# EAGLE design RJ45 - Breakout (EAGLE 9.6.2)
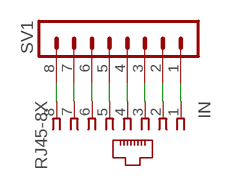
[diagram p0: schematic, sheet 1]

## Parts
IN  RJ45-8X  [RJ45-NO-SHIELD]
SV1  MA08-1  [MA08-1]

## Nets
1: IN.1 SV1.1
2: IN.2 SV1.2
3: IN.3 SV1.3
4: IN.4 SV1.4
5: IN.5 SV1.5
6: IN.6 SV1.6
7: IN.7 SV1.7
8: IN.8 SV1.8

## Library data of the parts
IN = con-tycoelectronics:RJ45: CORCOM Modular RJ Jacks No Shield Source: www.tycoelectronics.com .. ENG_DS_1654001_1099_RJ_L_0507.pdf; MPN: RJ45-8X; OC_FARNELL: unknown; OC_NEWARK: 16R6101
SV1 = con-lstb:MA08-1: PIN HEADER; OC_FARNELL: unknown; OC_NEWARK: unknown

## Board
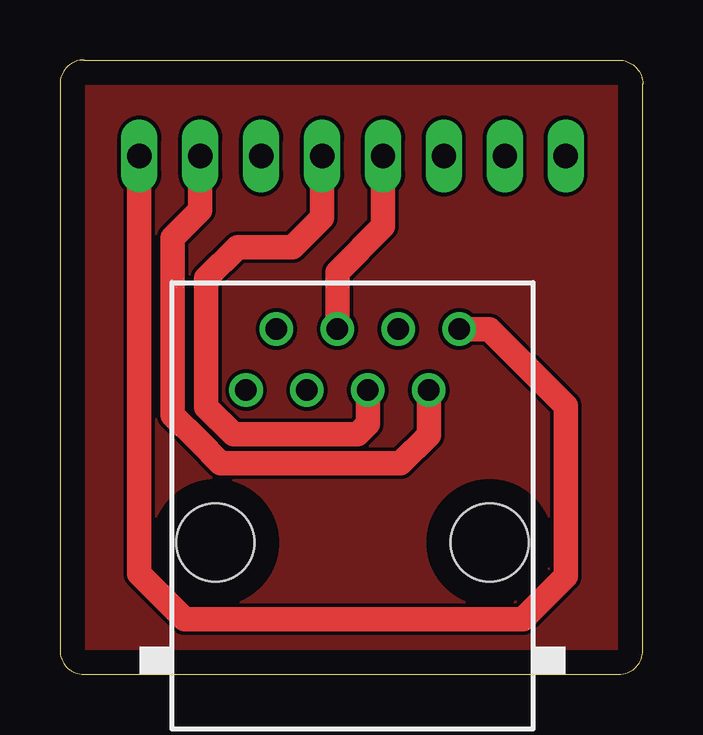
[diagram p1: board, top side]
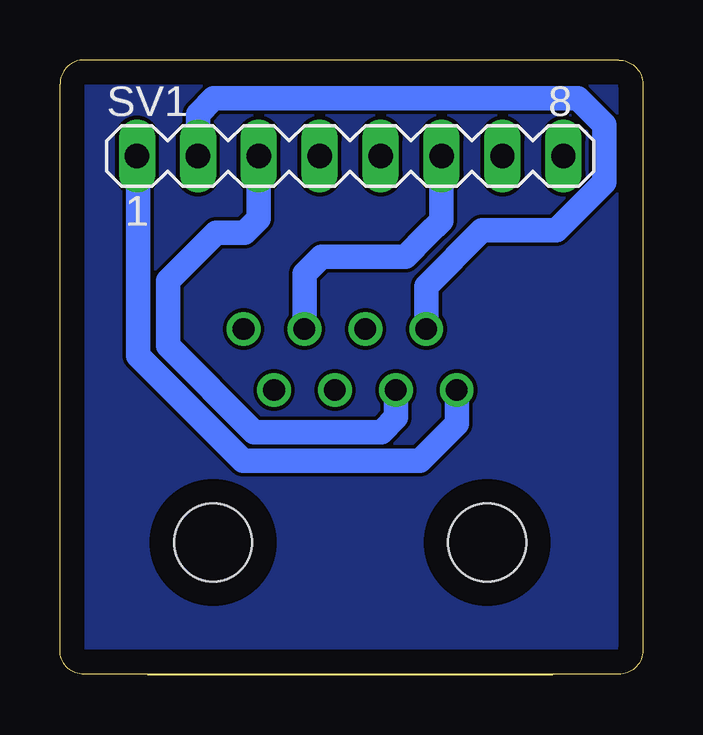
[diagram p2: board, bottom side, seen from below]

Size 24.3 x 25.61 mm. Coordinates in mm from the lower left corner, seen from the top.
Outline: 1,25.61 23.3,25.61 arc-90 24.3,24.61 24.3,1.01 arc-90 23.3,0.01 1,0.01 arc-90 0,1.01 0,24.61 arc-90 1,25.61
Copper layers (1*16): Top 0.035mm / dielectric 1.5mm / Bottom 0.035mm
Design rules "default": minimum track width 6mil, minimum drill 0.35mm, track to track 6mil, track to pad 6mil, pad to pad 6mil, via to via 6mil, smd to smd 6mil, copper to edge 40mil, drill to drill 6mil, minimum pad ring 10mil, minimum via ring 8mil, stop-mask expansion 4mil, vias tented up to drill 0mil, thermal gap 10mil

### Footprints (pad centres in the part's own frame; a part is rotated, then mirrored left to right if it is on the bottom)
RJ45-NO-SHIELD = drill 0.9 pad 1.4: 1 -4.445,6.35; 2 -3.175,8.89; 3 -1.905,6.35; 4 -0.635,8.89; 5 0.635,6.35; 6 1.905,8.89; 7 3.175,6.35; 8 4.445,8.89 | hole 3.251: -5.715,0; 5.715,0
MA08-1 = drill 1.016 long: 1 -8.89,0; 2 -6.35,0; 3 -3.81,0; 4 -1.27,0; 5 1.27,0; 6 3.81,0; 7 6.35,0; 8 8.89,0

### Placement (x,y rotation side)
IN  12.2,5.51 0 top
SV1  12.2,21.61 0 bottom

### Tracks (layer width: path | path; a pad name or v marks a point on that pad's centre or on a via)
1
  Bottom 1.016: SV1.1 21.03,21.5 21.03,13.28 16.66,8.91 9.3,8.91 7.75,10.46 IN.1
2
  Bottom 1.016: IN.2 9.03,16.19 6.7,18.51 3.6,18.51 1.6,20.51 1.6,22.91 2.7,24.01 17.9,24.01 18.55,23.36 SV1.2
3
  Bottom 1.016: IN.3 10.29,10.72 10.9,10.11 16.2,10.11 19.8,13.71 19.8,16.41 17.8,18.41 16.6,18.41 16.01,19 SV1.3
4
  Top 1.016: IN.4 11.56,16.78 13.47,18.68 SV1.4
5
  Top 1.016: SV1.5 10.93,19.04 9.7,17.81 7.4,17.81 6.1,16.51 6.1,11.14 7.23,10.01 12.4,10.01 12.84,10.45 IN.5
6
  Bottom 1.016: IN.6 14.11,16.71 13.4,17.41 9.9,17.41 8.99,18.32 8.39,18.92 SV1.6
7
  Top 1.016: IN.7 15.38,9.99 14.2,8.81 6.7,8.81 5.75,9.76 4.7,10.81 4.7,18.21 5.85,19.36 SV1.7
8
  Top 1.016: IN.8 17.91,14.4 18.6,13.71 21.1,11.21 21.1,4.11 19.3,2.31 5.2,2.31 3.31,4.2 3.31,10.6 SV1.8
GND
  pour Top: 0,25.61 24.3,25.61 24.3,0.01 0,0.01
  pour Bottom: 0,25.61 24.3,25.61 24.3,0.01 0,0.01